# EAGLE design ArduinoBase (EAGLE 7.4.0)
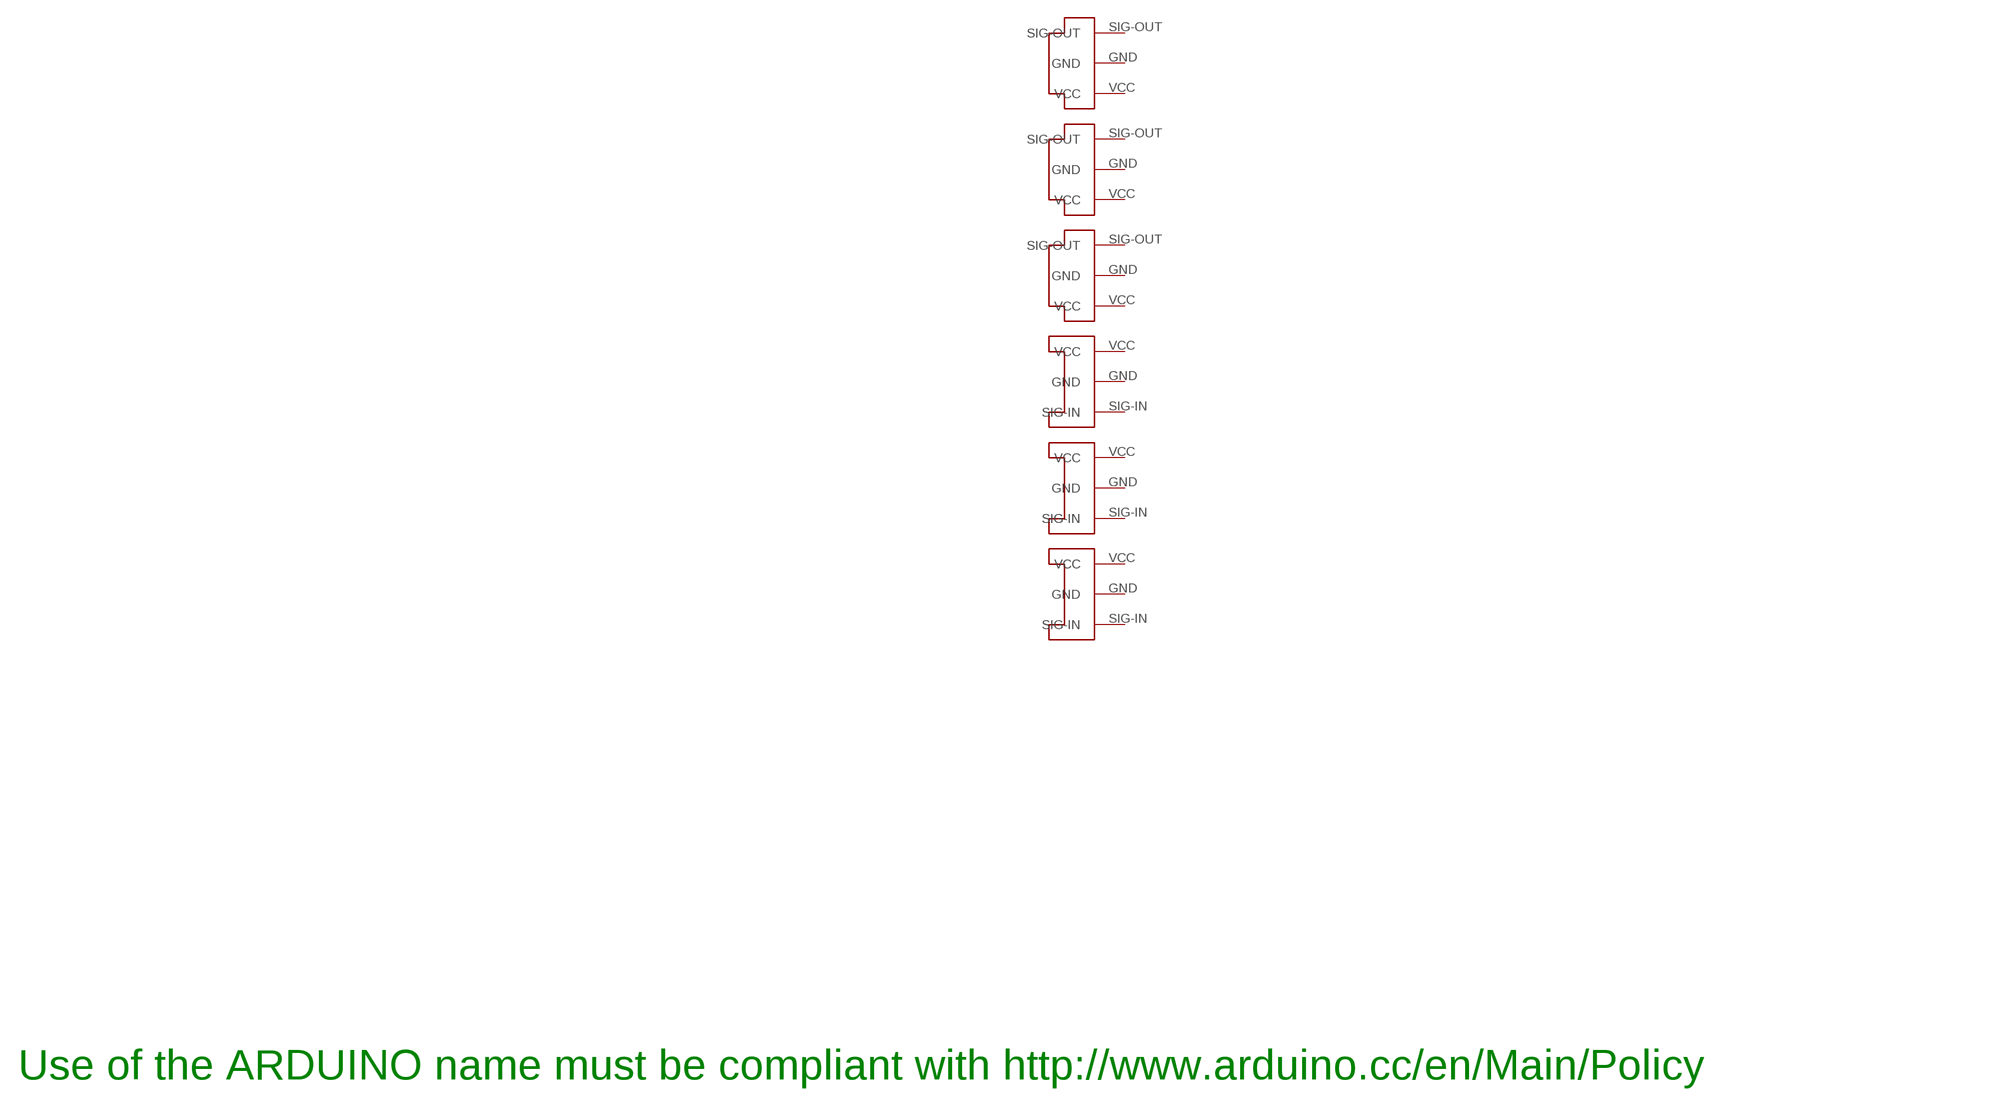
[diagram p0: schematic, sheet 1]

## Parts
U$1  CONN-SOCKET-3POS-3MM  [SOCKET-3POS-3MM-SMD]
U$2  CONN-PLUG-3POS-3MM  [PLUG-3POS-3MM-SMD]
U$3  CONN-PLUG-3POS-3MM  [PLUG-3POS-3MM-SMD]
U$4  CONN-PLUG-3POS-3MM  [PLUG-3POS-3MM-SMD]
U$5  CONN-SOCKET-3POS-3MM  [SOCKET-3POS-3MM-SMD]
U$6  CONN-SOCKET-3POS-3MM  [SOCKET-3POS-3MM-SMD]
Unconnected: U$1.SIG-IN U$2.SIG-OUT U$3.SIG-OUT U$4.SIG-OUT U$5.SIG-IN U$6.SIG-IN

## Notes on the sheet
- Use of the ARDUINO name must be compliant with http://www.arduino.cc/en/Main/Policy

## Power pins joined to a net without a drawn wire
GND: U$1.GND U$2.GND U$3.GND U$4.GND U$5.GND U$6.GND
VCC: U$1.VCC U$2.VCC U$3.VCC U$4.VCC U$5.VCC U$6.VCC

## Library data of the parts
U$1 U$5 U$6 = EmbeddedPlayground:CONN-SOCKET-3POS-3MM: Surface mount board to board connector. Female socket, 3 position.
U$2-U$4 = EmbeddedPlayground:CONN-PLUG-3POS-3MM: Surface mount board to board connector. Female socket, 3 position.

## Net classes
0 default: width 0.254 mm, clearance 0.254 mm
1 power: width 0.61 mm, drill 0.61 mm, clearance 0.254 mm
2 gnd: width 0.305 mm, drill 0.559 mm, clearance 0.254 mm
3 usbvcc: width 0.508 mm, drill 0.61 mm, clearance 0.254 mm
4 aref: width 0.406 mm, drill 0.61 mm, clearance 0.254 mm

## Board
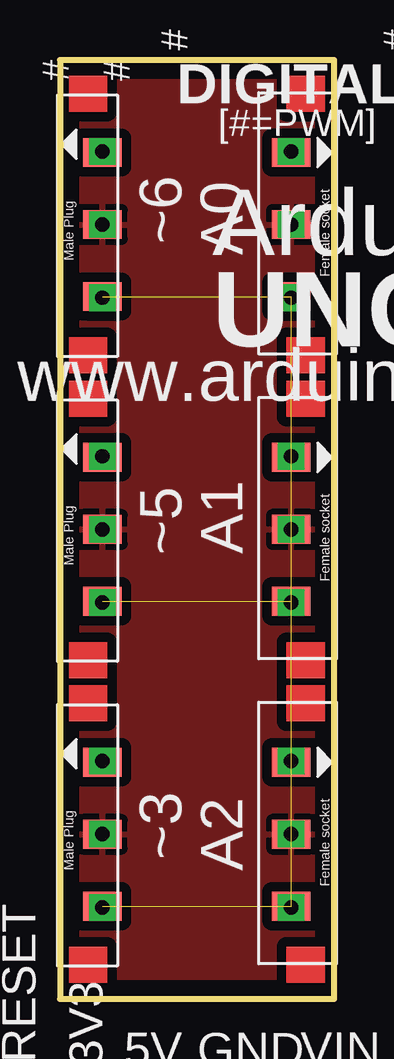
[diagram p1: board, top side]
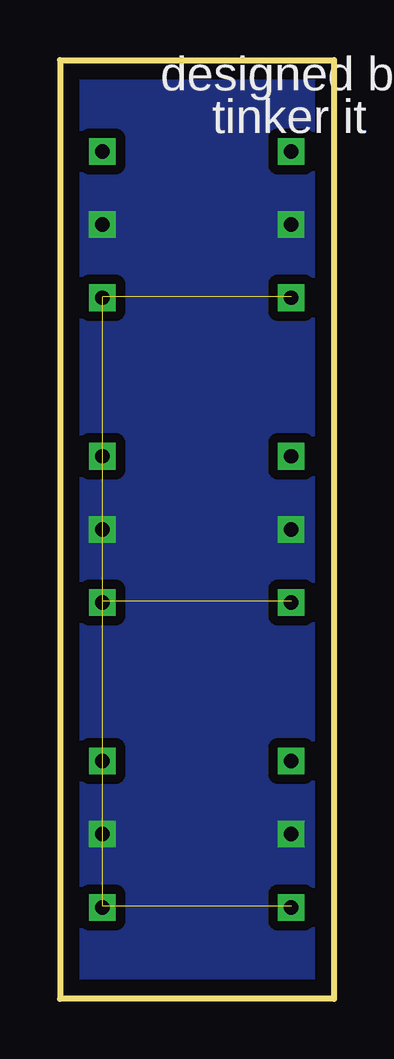
[diagram p2: board, bottom side, seen from below]

Size 11.43 x 39.12 mm. Coordinates in mm from the lower left corner, seen from the top.
Outline: 11.43,39.12 0,39.12 0,0 11.43,0 11.43,39.12
Copper layers (1*16): Top 0.035mm / dielectric 1.5mm / Bottom 0.035mm
Design rules "default": minimum track width 10mil, minimum drill 22mil, track to track 10mil, track to pad 10mil, pad to pad 10mil, via to via 12mil, smd to smd 8mil, copper to edge 26mil, drill to drill 12mil, minimum pad ring 10mil, minimum via ring 10mil, stop-mask expansion 1mil, vias tented up to drill 30mil, thermal gap 10mil
Holes 3.2 mm at 31.75,28.45 31.75,0.51 -19.05,43.69 -20.32,-4.57
vRestrict: area -11.4,37 to -9.7,42; area -8.9,38.4 to -7.2,42; area -5.8,38.2 to -4.7,41.7; area -3.3,38.2 to -2.2,41.7; area -0.8,38.2 to 0.4,41.7; area 1.8,38.2 to 2.9,41.7; area 4.4,40.1 to 5.6,41.7; area 6,38 to 13.3,39.8; area 26,37.1 to 27.4,39.6; area 28.6,37.1 to 30,39.6; area 27.1,28.7 to 30.5,30.1; area -33.7,14.7 to -32.3,23; 14 more areas

### Footprints (pad centres in the part's own frame; a part is rotated, then mirrored left to right if it is on the bottom)
SOCKET-3POS-3MM-SMD = smd 1.2 x 1.6: GND 0,0; SIG-IN -3,0; VCC 3,0
PLUG-3POS-3MM-SMD = smd 1.2 x 1.6: GND 0,0; SIG-OUT 3,0; VCC -3,0

### Placement (x,y rotation side)
U$1  9.65,6.86 270 top
U$2  1.78,32.26 90 top
U$3  1.78,19.56 90 top
U$4  1.78,6.86 90 top
U$5  9.65,19.56 270 top
U$6  9.65,32.26 270 top

### Tracks (layer width: path | path; a pad name or v marks a point on that pad's centre or on a via)
GND  (via drill 0.6)
  other vias: 1.78,32.26 9.65,32.26 9.65,19.56 1.78,19.56 9.65,6.86 1.78,6.86
  pour Bottom (isolate 0.406, rank 2): -34.29,51.31 34.29,51.31 34.29,-12.19 -34.29,-12.19
  pour Top (isolate 0.406, rank 2): -34.29,48.77 34.29,48.77 34.29,-9.65 -34.29,-9.65
N$2  (via drill 0.6)
  other vias: 1.78,35.31
N$3  (via drill 0.6)
  other vias: 1.78,29.21
N$4  (via drill 0.6)
  other vias: 9.65,35.31
N$5  (via drill 0.6)
  other vias: 9.65,29.21
N$6  (via drill 0.6)
  other vias: 1.78,22.61
N$7  (via drill 0.6)
  other vias: 9.65,22.61
N$8  (via drill 0.6)
  other vias: 1.78,16.51
N$9  (via drill 0.6)
  other vias: 9.65,16.51
N$10  (via drill 0.6)
  other vias: 9.65,9.91
N$11  (via drill 0.6)
  other vias: 1.78,9.91
N$12  (via drill 0.6)
  other vias: 1.78,3.81
N$13  (via drill 0.6)
  other vias: 9.65,3.81
VCC  (5 unrouted)

### Text on the board
tPlace: ~6 | A0 | ~5 | A1 | ~3 | A2
tNames: SCL | SDA | M.Banzi | D.Cuartielles | T.Igoe | AREF | GND | G.Martino | # | # | # | # | D.Mellis | # | # | DIGITAL | [#=PWM] | TX | RX | TM | TX | Arduino | RX | UNO | www.arduino.cc | 1 | ANALOG IN | IOREF | RESET | 3V3 | 5V | GND | VIN | A0 | A1 | A2 | A3 | A4 | A5
bNames: MADE IN | designed by | MADE IN | ITALY | tinker it | ITALY | designed by | tinker it | ATMEGA328
ReferenceLC: L | TX | ON | RX | PC1 | PC2
214bmp: D:/SmartProjects/Snc/a4_bn_logo2.bmp